# EAGLE design Lüftungssteuerung (EAGLE 7.2.0)
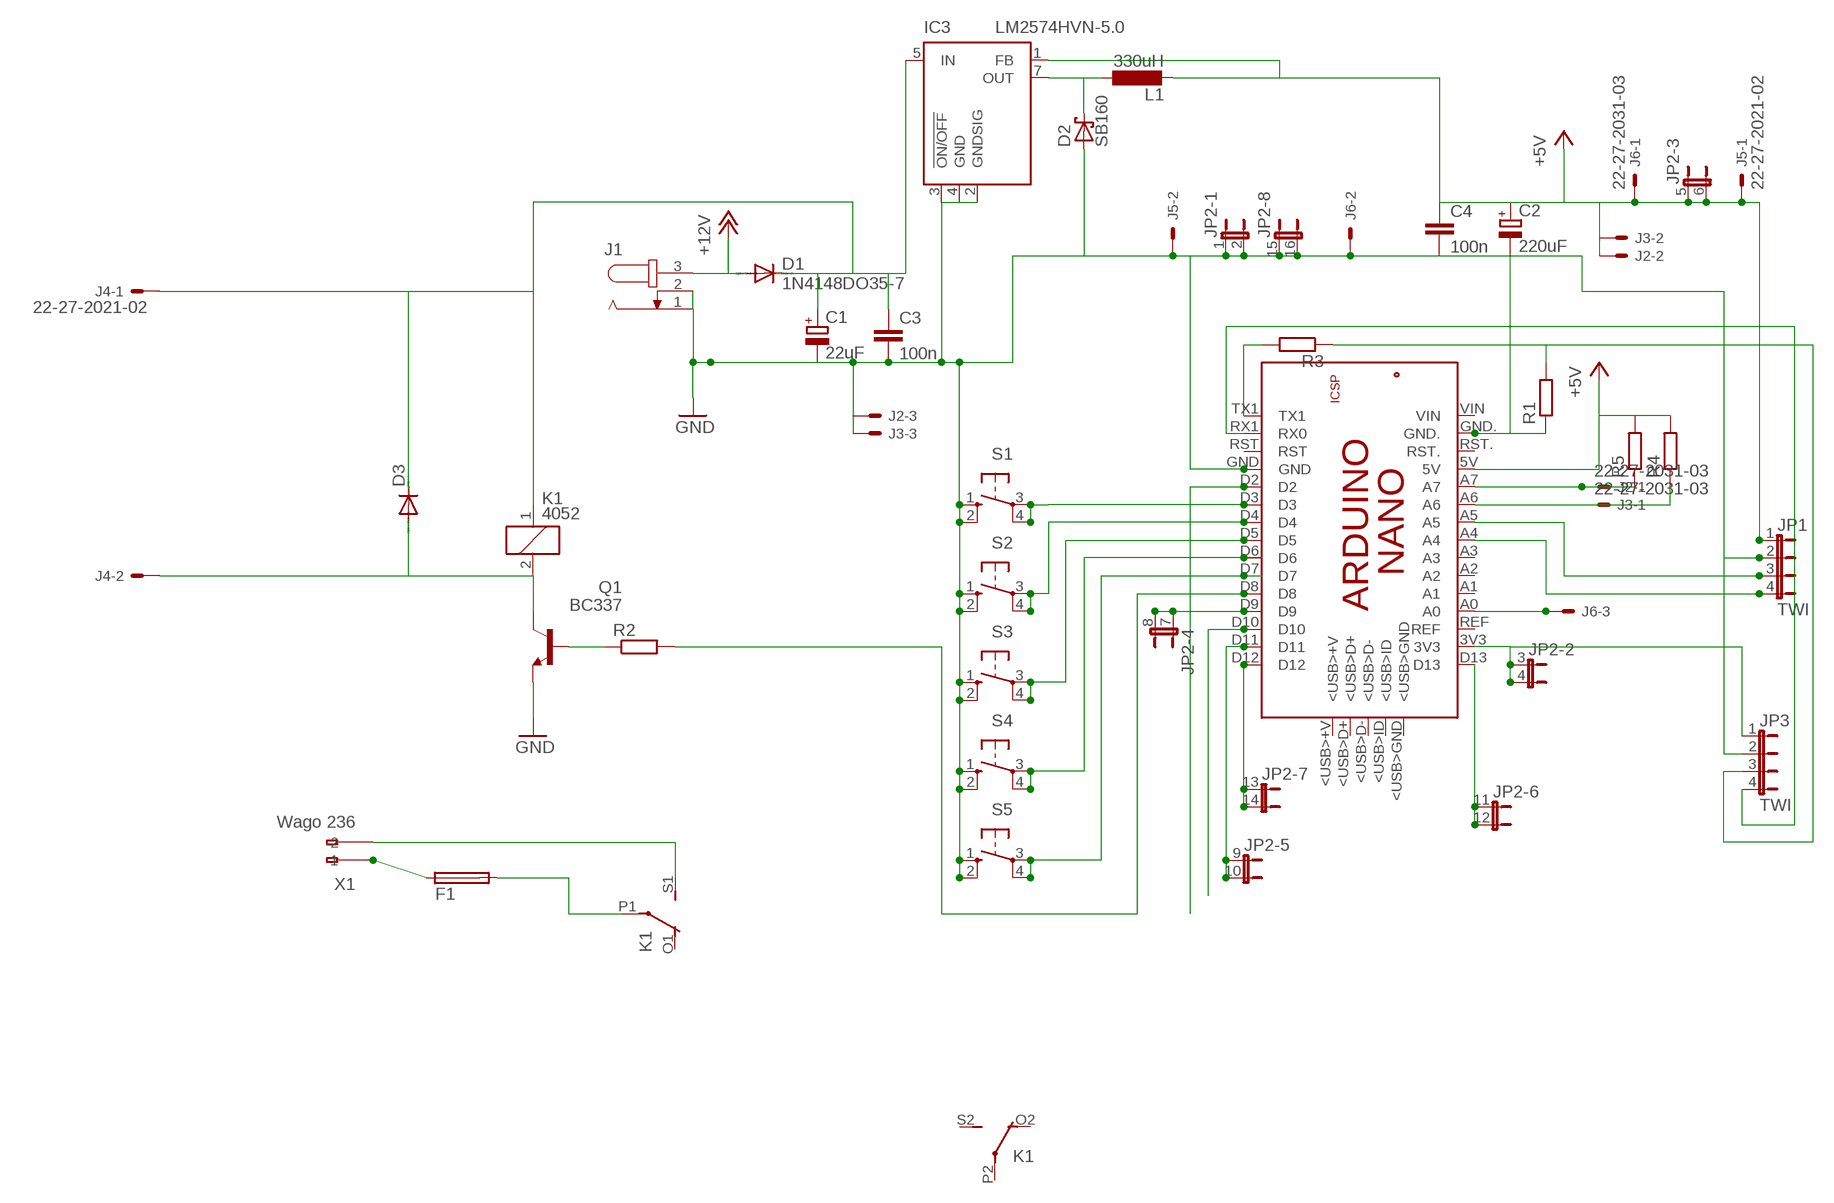
[diagram p0: schematic, sheet 1]

## Parts
C1  22uF  CPOL-EUE2-5  [E2-5]
C2  220uF  CPOL-EUE5-10.5  [E5-10,5]
C3  100n  C-EUC1206  [C1206]
C4  100n  C-EUC1206  [C1206]
D1  1N4148DO35-7  [DO35-7]
D2  SB160  1N5817-B  [DO41-7.6]
D3  DIODE-DO41-7.6  [DO41-7.6]
F1  SH22,5  [SH22,5]
IC3  LM2574HVN-5.0  [DIL08]
J1  JACK-PLUG0  [SPC4077]
J2  22-27-2031-03  [6410-03]
J3  22-27-2031-03  [6410-03]
J4  22-27-2021-02  [6410-02]
J5  22-27-2021-02  [6410-02]
J6  22-27-2031-03  [6410-03]
JP1  TWI  JP4E  [JP4]
JP2  JP8QE  [JP8Q]
JP3  TWI  JP4E  [JP4]
K1  4052  [F4052]
L1  330uH  L-EUPIS47XX  [PIS47XX]
PCB1  ARDUINO_NANO  [ARDUINO_NANO]
Q1  BC337  [TO92]
R1  R-EU_R1206  [R1206]
R2  R-EU_R1206  [R1206]
R3  R-EU_R1206  [R1206]
R4  R-EU_R1206  [R1206]
R5  R-EU_R1206  [R1206]
S1  10-XX  [B3F-10XX]
S2  10-XX  [B3F-10XX]
S3  10-XX  [B3F-10XX]
S4  10-XX  [B3F-10XX]
S5  10-XX  [B3F-10XX]
X1  Wago 236  255-402-508  [255-402-508]

## Nets
+5V: C2.+ C4.1 IC3.1(FB) J2.2 J3.2 J5.1 J6.1 JP1.1 JP2.5 JP2.6 L1.1 PCB1.5V R4.2 R5.2
+12V: D1.A J1.3
GND: C1.- C2.- C3.2 C4.2 D2.A IC3.2(GNDSIG) IC3.3(!ON/OFF) IC3.4(GND) J1.1 J1.2 J2.3 J3.3 J5.2 J6.2 JP1.2 JP2.1 JP2.2 JP2.15 JP2.16 JP3.2 PCB1.GND PCB1.GND. Q1.1(E) R1.1 S1.1(S) S1.2(S1) S2.1(S) S2.2(S1) S3.1(S) S3.2(S1) S4.1(S) S4.2(S1) S5.1(S) S5.2(S1)
N$1: C1.+ C3.1 D1.C D3.C IC3.5(IN) J4.1 K1.1
N$2: JP1.3 PCB1.A5
N$3: J2.1 PCB1.A7 R5.1
N$4: J3.1 PCB1.A6 R4.1
N$5: JP1.4 PCB1.A4
N$6: JP2.7 JP2.8 PCB1.D9
N$7: J6.3 PCB1.A0
N$9: JP3.4 PCB1.RX1(RX0)
N$10: PCB1.TX1 R3.2
N$11: JP3.3 R1.2 R3.1
N$12: JP2.11 JP2.12 PCB1.D13
N$13: PCB1.D3 S1.3(P) S1.4(P1)
N$14: PCB1.D4 S2.3(P) S2.4(P1)
N$15: D3.A J4.2 K1.2 Q1.3(C)
N$16: Q1.2(B) R2.1
N$17: PCB1.D7 S5.3(P) S5.4(P1)
N$18: JP2.3 JP2.4 JP3.1 PCB1.3V3
N$19: JP2.13 JP2.14 PCB1.D12
N$20: JP2.9 JP2.10 PCB1.D11
N$22: PCB1.D10
N$23: PCB1.D2
N$24: PCB1.D6 S4.3(P) S4.4(P1)
N$25: PCB1.D5 S3.3(P) S3.4(P1)
N$26: PCB1.D8 R2.2
N$27: K1.S1(2:S) X1.A2(-2)
N$28: F1.2 K1.P1(2:P)
N$29: F1.1 X1.A1(-1)
N$33: D2.C IC3.7(OUT) L1.2
Unconnected: K1.O1(2:O) K1.O2(3:O) K1.P2(3:P) K1.S2(3:S) PCB1.5V. PCB1.<USB>+V PCB1.<USB>D+ PCB1.<USB>D- PCB1.<USB>GND PCB1.<USB>ID PCB1.A1 PCB1.A2 PCB1.A3 PCB1.GND_ PCB1.MISO PCB1.MOSI PCB1.REF PCB1.RESET.. PCB1.RST PCB1.RST. PCB1.SCK PCB1.VIN X1.B1(B-1) X1.B2(B-2)

## Library data of the parts
C1 C2 = rcl:CPOL-EU: POLARIZED CAPACITOR, European symbol
C3 C4 = rcl:C-EU: CAPACITOR, European symbol
D1 = diode:1N4148: DIODE high speed (Philips)
D2 = diode:1N581*: 1.0A SCHOTTKY BARRIER RECTIFIER Source: http://www.diodes.com/datasheets/ds23001.pdf
D3 = diode:DIODE-: DIODE
F1 = fuse:SH22,5: FUSE HOLDER grid 22,5 mm, OGN0031 8201, Schurter (Buerklin); MF: SCHURTER; MPN: 0031.8201; OC_FARNELL: 1162740; OC_NEWARK: 96F8317
IC3 = linear:LM2574?-*: SIMPLE SWITCHER 0.5A Step-Down Voltage Regulator Source: http://cache.national.com/ds/LM/LM2574.pdf
J1 = con-jack:JACK-PLUG: DC POWER JACK Power Jack, DC, Right Angle, Through Hole, Rated 5A at 16VDC, PC Terminals Distributor: Farnell (www.Farnell.de) Drawing: 84N1161.pdf / 84N1162.pdf Manufacturer: SPC Technology (www.spctechnology.com) Type: SPC4077 / SPC 4078; OC_FARNELL: unknown; OC_NEWARK: unknown
J2 J3 J6 = con-molex:22-?-03: CONNECTOR wire to board 2.54 mm (.1 inch) pitch header; OC_FARNELL: unknown; OC_NEWARK: unknown
J4 J5 = con-molex:22-?-02: CONNECTOR wire to board 2.54 mm (.1 inch) pitch header; OC_FARNELL: unknown; OC_NEWARK: unknown
JP1 JP3 = jumper:JP4E: JUMPER
JP2 = jumper:JP8QE: JUMPER
K1 = relay:4052: RELAY 2 x switch, Finder; OC_FARNELL: unknown; OC_NEWARK: unknown
L1 = Inductor-Fastron:L-EU
PCB1 = E14_Arduino_revB:ARDUINO_NANO: Device for representing an Arduino Nano board with a footprint in an EAGLE design. Created by Dave Young for Element14. More EAGLE documentation at: http://www.element14.com/community/community/knode/cadsoft_eagle
Q1 = transistor-npn:BC337*: NPN Transistor
R1-R5 = rcl:R-EU_: RESISTOR, European symbol
S1-S5 = switch-omron:10-XX: OMRON SWITCH; MPN: B3F-1000; OC_FARNELL: 176432; OC_NEWARK: 36M3542
X1 = con-wago255:255-402-5: WAGO; OC_FARNELL: unknown; OC_NEWARK: unknown

## Board
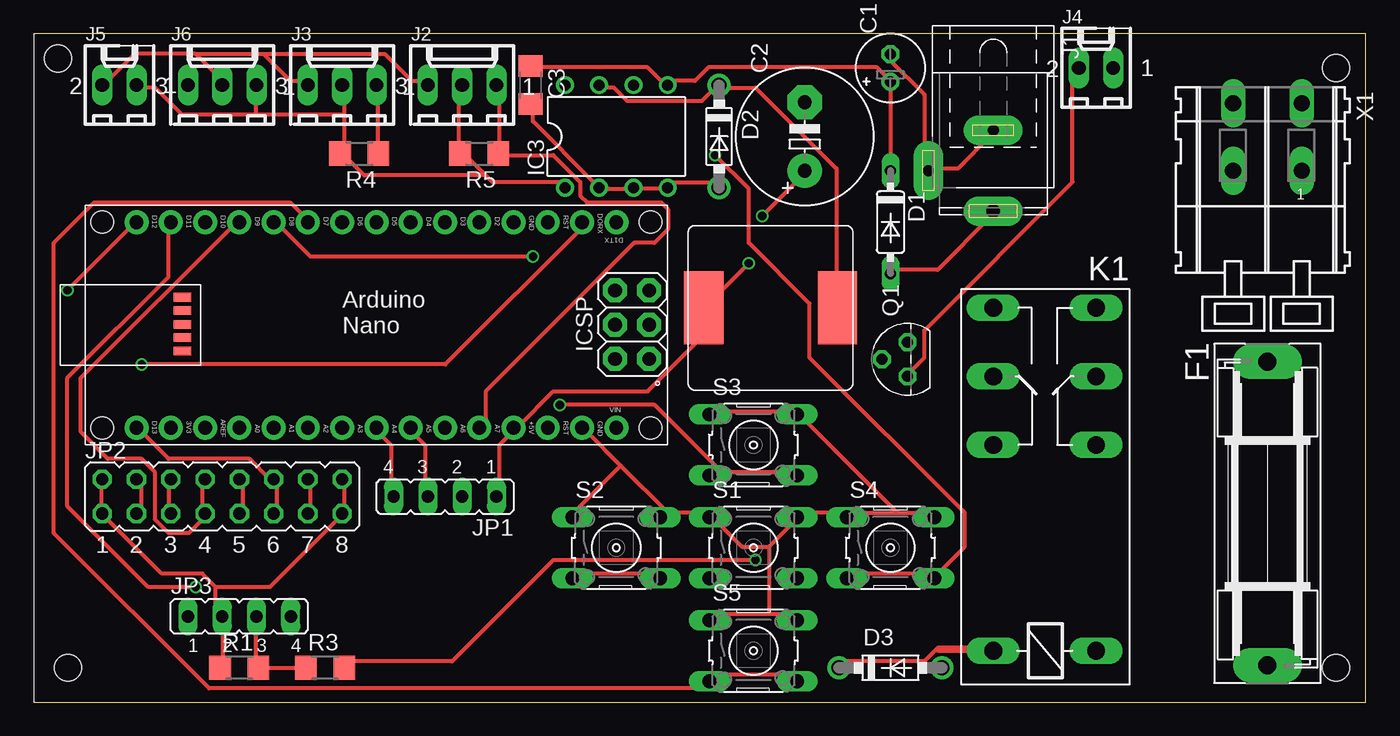
[diagram p1: board, top side]
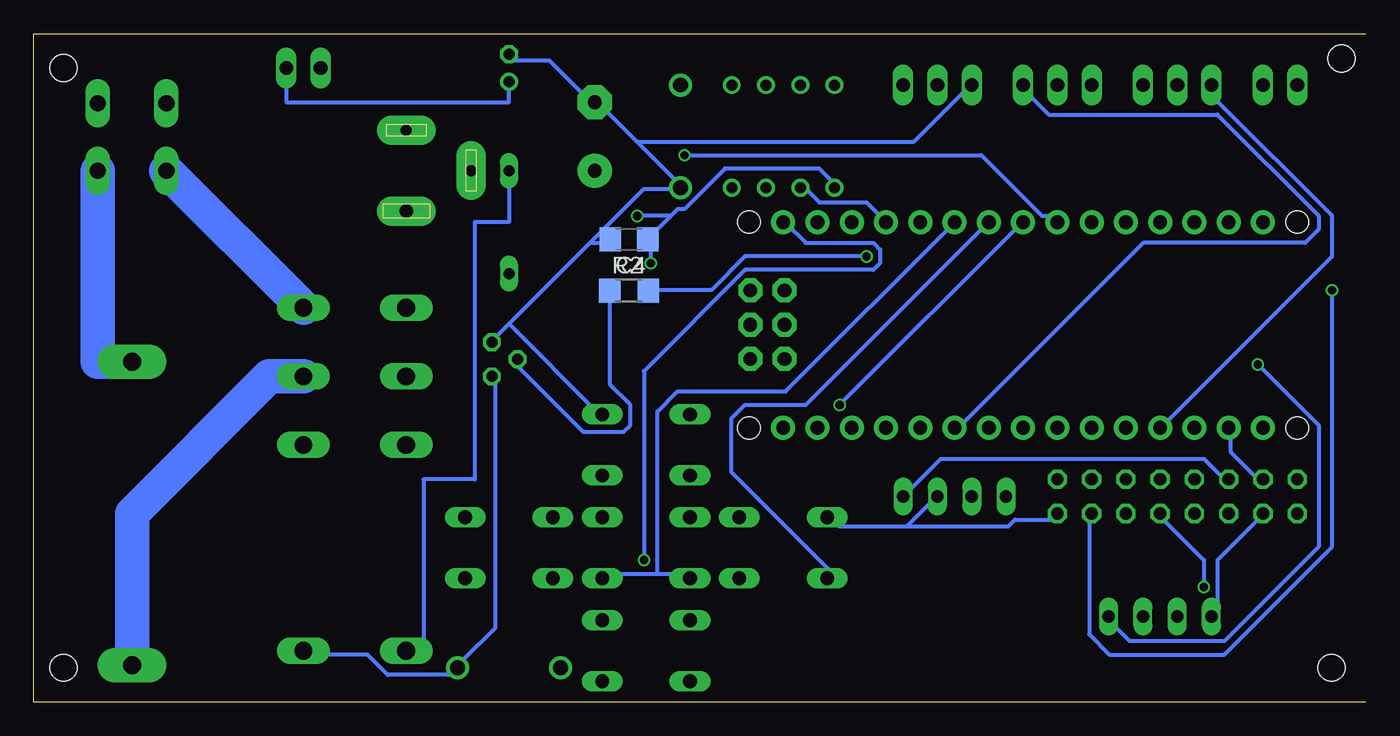
[diagram p2: board, bottom side, seen from below]

Size 98.73 x 49.52 mm. Coordinates in mm from the lower left corner, seen from the top.
Outline: 0,0 98.73,0 98.73,49.52 0,49.52
Copper layers (1*16): Top 0.035mm / dielectric 1.5mm / Bottom 0.035mm
Design rules "SeeedStudio_2layer_DRU_no_angle_20140221 *": minimum track width 12mil, minimum drill 24mil, track to track 10mil, track to pad 10mil, pad to pad 10mil, via to via 10mil, smd to smd 0mil, copper to edge 10mil, drill to drill 10mil, minimum pad ring 10mil, minimum via ring 6mil, stop-mask expansion 2mil, vias tented up to drill 100mil, thermal gap 10mil
Holes 2 mm at 1.8,47.69 2.54,2.54 96.52,2.54 96.52,46.99
tRestrict: area 74.9,0.6 to 98.4,48.3
bRestrict: area 74.9,0.6 to 98.4,48.3

### Footprints (pad centres in the part's own frame; a part is rotated, then mirrored left to right if it is on the bottom)
E2-5 = drill 0.813 pad 1.27: + -1.016,0 | drill 0.813 pad 1.27 octagon: - 1.016,0
E5-10,5 = drill 1.016 pad 2.54: + -2.54,0 | drill 1.016 pad 2.54 octagon: - 2.54,0
C1206 = smd 1.6 x 1.8: 1 -1.4,0; 2 1.4,0
DO35-7 = drill 0.813 long: A 3.81,0; C -3.81,0
DO41-7.6 = drill 1.1 pad 1.7: A 3.81,0; C -3.81,0
SH22,5 = drill 1.321 pad 2.54 long: 1 -11.252,0; 2 11.252,0
DIL08 = drill 0.813 pad 1.27: 1 -3.81,-3.81; 2 -1.27,-3.81; 3 1.27,-3.81; 4 3.81,-3.81; 5 3.81,3.81; 6 1.27,3.81; 7 -1.27,3.81; 8 -3.81,3.81
SPC4077 = drill 0.8 pad 2.184 long: 1 -3,0; 2 0,-4.8 | drill 1 pad 2.184 long: 3 3,0
6410-03 = drill 1.016 long: 1 2.54,0; 2 0,0; 3 -2.54,0
6410-02 = drill 1.016 long: 1 1.27,0; 2 -1.27,0
JP4 = drill 0.914 long: 1 -3.81,0; 2 -1.27,0; 3 1.27,0; 4 3.81,0
JP8Q = drill 0.914 octagon: 1 -8.89,-1.27; 2 -8.89,1.27; 3 -6.35,-1.27; 4 -6.35,1.27; 5 -3.81,-1.27; 6 -3.81,1.27; 7 -1.27,-1.27; 8 -1.27,1.27; 9 1.27,-1.27; 10 1.27,1.27; 11 3.81,-1.27; 12 3.81,1.27; 13 6.35,-1.27; 14 6.35,1.27; 15 8.89,-1.27; 16 8.89,1.27
F4052 = drill 1.321 long: 1 -3.81,3.81; 2 -3.81,-3.81; O1 11.43,-3.81; O2 11.43,3.81; P1 16.51,-3.81; P2 16.51,3.81; S1 21.59,-3.81; S2 21.59,3.81
PIS47XX = smd 2.9 x 5.4: 1 -4.95,0; 2 4.95,0
ARDUINO_NANO = drill 1.016 pad 1.778: 3V3 6.35,1.27; 5V 31.75,1.27; A0 11.43,1.27; A1 13.97,1.27; A2 16.51,1.27; A3 19.05,1.27; A4 21.59,1.27; A5 24.13,1.27; A6 26.67,1.27; A7 29.21,1.27; D2 29.21,16.51; D3 26.67,16.51; D4 24.13,16.51; D5 21.59,16.51; D6 19.05,16.51; D7 16.51,16.51; D8 13.97,16.51; D9 11.43,16.51; D10 8.89,16.51; D11 6.35,16.51; D12 3.81,16.51; D13 3.81,1.27; GND 31.75,16.51; GND. 36.83,1.27; REF 8.89,1.27; RST 34.29,16.51; RST. 34.29,1.27; RX1 36.83,16.51; TX1 39.37,16.51; VIN 39.37,1.27 | drill 1.016 pad 1.778 octagon: 5V. 39.268,6.375; GND_ 39.268,11.455; MISO 41.808,6.375; MOSI 39.268,8.915; RESET.. 41.808,11.455; SCK 41.808,8.915 | smd 1.27 x 0.635: <USB>+V 7.214,10.947; <USB>D+ 7.214,9.957; <USB>D- 7.214,8.941; <USB>GND 7.214,6.96; <USB>ID 7.214,7.976 | hole 1.651: 1.27,1.27; 1.27,16.51; 41.91,16.51; 41.91,1.27
TO92 = drill 0.813 octagon: 1 1.27,0; 2 0,1.905; 3 -1.27,0
R1206 = smd 1.6 x 1.803: 1 -1.422,0; 2 1.422,0
B3F-10XX = drill 1.016 long: 1 -3.251,2.261; 2 3.251,2.261; 3 -3.251,-2.261; 4 3.251,-2.261
255-402-508 = drill 1.2 long: A1 -2.54,0; A2 2.54,0; B1 -2.54,-5; B2 2.54,-5

### Placement (x,y rotation side)
C1  63.5,46.99 90 top
C2  57.15,41.91 90 top
C3  36.83,45.72 270 top
C4  54.61,34.29 180 bottom
D1  63.5,35.56 270 top
D2  50.8,41.91 270 top
D3  63.5,2.54 0 top
F1  91.44,13.97 270 top
IC3  43.18,41.91 0 top
J1  71.12,39.37 270 top
J2  31.75,45.72 0 top
J3  22.86,45.72 0 top
J4  78.74,46.99 0 top
J5  6.35,45.72 0 top
J6  13.97,45.72 0 top
JP1  30.48,15.24 180 top
JP2  13.97,15.24 0 top
JP3  15.24,6.35 0 top
K1  74.93,7.62 90 top
L1  54.61,29.21 0 top
PCB1  3.81,19.05 0 top
Q1  64.77,25.4 90 top
R1  15.24,2.54 0 top
R2  54.61,30.48 0 bottom
R3  21.59,2.54 0 top
R4  24.13,40.64 180 top
R5  33.02,40.64 180 top
S1  53.34,11.43 0 top
S2  43.18,11.43 0 top
S3  53.34,19.05 0 top
S4  63.5,11.43 0 top
S5  53.34,3.81 0 top
X1  91.44,39.37 180 top

### Tracks (layer width: path | path; a pad name or v marks a point on that pad's centre or on a via)
+5V  (via drill 0.61)
  Top 0.305: JP2.5 10,14.02 10,16.02 JP2.6 | JP1.1 34.5,15.52 34.5,19.02 35.5,20.02 PCB1.5V 36,20.52 38.5,23.02 45.5,23.02 49.5,27.02 49.5,29.02 L1.1 50,29.52 v53,32.52 | 23,43.52 23,45.52 J3.2 | 23,43.52 23,41.02 R4.2 23,40.52 24.5,39.02 33.5,39.02 | 23,43.52 16.5,43.52 | 16.5,43.52 11,43.52 9,45.52 8,45.52 J5.1 | 16.5,43.52 16.5,45.52 J6.1 | J2.2 31.5,45.52 31.5,41.02 R5.2 32,40.52 33.5,39.02 | 33.5,39.02 34,38.52 39,38.52 IC3.1 | v54,36.02 57,39.02 C2.+
  Bottom 0.305: JP2.6 10.5,16.52 12,18.02 31.5,18.02 34,15.52 JP1.1 | 51.5,36.02 51,36.52 50.5,36.52 47.5,39.52 40.5,39.52 39.5,38.52 IC3.1 | 51.5,36.02 53,34.52 C4.1 53,34.02 v53,32.52 | 51.5,36.02 v54,36.02
+12V
  Top 0.305: D1.A 63.5,32.02 67,32.02 71,36.02 J1.3
GND
  Top 0.305: 12,48.02 7.5,48.02 5.5,46.02 J5.2 | 12,48.02 14,46.02 J6.2 | 17,48.02 19,46.02 20,46.02 J3.3 | 12,48.02 17,48.02 | 17,48.02 26,48.02 28,46.02 29,46.02 J2.3 | D2.A 50.5,38.52 47,38.52 IC3.4 46.5,38.02 44.5,38.02 IC3.3 44,38.02 42,38.02 IC3.2 41.5,38.52 37,43.02 37,44.02 C3.2 | J1.1 71,42.02 68.5,39.52 66.5,39.52 J1.2 66,39.52 66,45.02 63.5,47.52 C1.- | S3.1 50.5,21.52 56.5,21.52 S3.2 57,21.02 64,14.02 | 54.5,6.52 56.5,6.52 S5.2 | 54.5,6.52 50.5,6.52 S5.1 | 64,14.02 60.5,14.02 S4.1 60,14.02 57,14.02 S1.2 56.5,13.52 54.5,11.52 | 64,14.02 66.5,14.02 S4.2 | 54.5,11.52 54.5,6.52 | JP2.2 5,16.02 5,14.02 JP2.1 5.5,13.52 9.5,9.52 12.5,9.52 13.5,8.52 | R1.1 14,3.02 14,6.02 JP3.2 13.5,6.52 13.5,8.52 | 47,14.02 50,14.02 S1.1 50.5,13.52 52.5,11.52 54.5,11.52 | 47,14.02 46.5,14.02 S2.2 47,14.02 | 47,14.02 43.5,17.52 | 43.5,17.52 41,20.02 PCB1.GND. | JP2.16 23,16.02 23,14.02 JP2.15 22.5,13.52 17.5,8.52 13.5,8.52 | 43.5,17.52 40,14.02 S2.1
  Bottom 0.305: PCB1.GND 36,36.02 37,37.02 40.5,37.02 41.5,38.02 IC3.2 | C1.- 63.5,47.52 60.5,47.52 57.5,44.52 C2.- 57,44.52 54,41.52 | 54,41.52 51,38.52 D2.A 51,38.02 53.5,38.02 57.5,34.02 | 54,41.52 33.5,41.52 29.5,45.52 J2.3 | 57.5,34.02 56.5,34.02 C4.2 | 63.5,28.02 64.5,27.02 Q1.1 | 63.5,28.02 57.5,34.02 | 63.5,28.02 57,21.52 S3.2 | 34,13.02 32,15.02 JP1.2 | 34,13.02 39,13.02 39.5,13.52 S2.1 | 34,13.02 26.5,13.02 26,13.52 23,13.52 JP2.15
N$1
  Top 0.305: 67,4.02 66,3.02 60,3.02 D3.C | 67,4.02 71,4.02 K1.1 67,3.81 67,4.02 | C3.1 37,47.02 45.5,47.02 46.5,46.02 IC3.5 47,46.02 49,46.02 50,47.02 62.5,47.02 63.5,46.02 C1.+ D1.C
  Bottom 0.305: J4.1 80.01,44.45 63.5,44.45 C1.+ | D1.C 63.5,35.56 66.04,35.56 66.04,16.51 69.85,16.51 69.85,3.81 K1.1
N$2
  Top 0.305: JP1.3 29,15.52 29,19.02 28,20.02 PCB1.A5
N$3
  Top 0.305: J2.1 34.5,45.52 34.5,41.02 R5.1 34.5,40.52 38.5,40.52 40.5,38.52 40.5,37.52 41,37.02 46.5,37.02 47,36.52 47,35.02 46,34.02 44.5,34.02 33.5,23.02 33.5,20.52 PCB1.A7
N$4
  Top 0.305: R4.1 25.5,41.02 25.5,45.52 J3.1
  Bottom 0.305: PCB1.A6 30,20.52 16.5,34.02 4.5,34.02 3.5,35.02 3.5,36.02 11,43.52 23.5,43.52 25.5,45.52 J3.1
N$5
  Top 0.305: JP1.4 26.5,15.52 26.5,19.02 25.5,20.02 PCB1.A4
N$6
  Top 0.305: JP2.8 12.5,16.02 12.5,14.02 JP2.7 12.5,13.52 11.5,12.52 10,12.52 9,13.52 9,17.02 8,18.02 5.5,18.02 3.5,20.02 3.5,24.02 15,35.52 PCB1.D9
N$7
  Bottom 0.305: J6.3 11,45.52 11,44.52 2.5,36.02 2.5,33.02 15,20.52 PCB1.A0
N$9  (via drill 0.61)
  Top 0.305: v8,25.02 30.5,25.02 41,35.52 PCB1.RX1
  Bottom 0.305: v8,25.02 3.5,20.52 3.5,11.52 10.5,4.52 17.5,4.52 19,6.02 JP3.4
N$10  (via drill 0.61)
  Top 0.305: v53.5,10.52 38.5,10.52 31,3.02 23.5,3.02 R3.2
  Bottom 0.305: v53.5,10.52 53.5,24.52 46,32.02 36.5,32.02 36,32.52 36,33.52 36.5,34.02 41.5,34.02 43,35.52 PCB1.TX1
N$11
  Top 0.305: R3.1 20,2.52 17,2.52 R1.2 16.5,3.02 16.5,6.02 JP3.3
N$12
  Top 0.305: JP2.11 18,14.02 18,16.02 JP2.12 17.5,16.52 16,18.02 10,18.02 8,20.02 PCB1.D13
N$13
  Bottom 0.305: 52.5,9.52 56.5,9.52 S1.4 | 52.5,9.52 50.5,9.52 S1.3 | 52.5,9.52 52.5,21.52 51,23.02 43,23.02 30.5,35.52 PCB1.D3
N$14
  Top 0.305: S2.3 40,9.52 46,9.52 S2.4
  Bottom 0.305: PCB1.D4 28,35.52 41.5,22.02 46,22.02 47,21.02 47,17.02 39.5,9.52 S2.3
N$15
  Top 0.305: J4.2 77,46.52 77,38.52 66,27.52 66,25.52 65,24.52 Q1.3
  Bottom 0.305: Q1.3 64.5,24.02 64.5,5.52 67,3.02 D3.A 67.5,2.52 68,2.02 72.5,2.02 74,3.52 78.5,3.52 K1.2
N$16
  Bottom 0.305: R2.1 56,30.02 56,23.52 54.5,22.02 54.5,20.52 55,20.02 58,20.02 63,25.02 Q1.2
N$17
  Top 0.305: S5.4 56.5,2.02 50.5,2.02 S5.3 50,1.52 49.5,1.02 13,1.02 1.5,12.52 1.5,34.02 4.5,37.02 19,37.02 20,36.02 PCB1.D7
N$18
  Top 0.305: JP2.4 8,16.02 8,14.02 JP2.3
  Bottom 0.305: JP3.1 11,6.52 11,10.52 8,13.52 JP2.3 | PCB1.3V3 10,20.02 10,18.52 8,16.52 JP2.4
N$19  (via drill 0.61)
  Top 0.305: JP2.13 20.5,14.02 20.5,16.02 JP2.14 | v2.5,30.52 7.5,35.52 PCB1.D12
  Bottom 0.305: v2.5,30.52 2.5,11.52 10.5,3.52 19,3.52 20.5,5.02 20.5,13.52 JP2.13
N$20  (via drill 0.61)
  Top 0.305: JP2.9 15.5,14.02 15.5,16.02 JP2.10 | v12,8.52 8.5,8.52 2.5,14.52 2.5,24.02 10,31.52 10,35.52 PCB1.D11
  Bottom 0.305: v12,8.52 12,10.52 15,13.52 JP2.9
N$24  (via drill 0.61)
  Top 0.305: S4.3 60.5,9.52 66.5,9.52 S4.4 67,9.52 69,11.52 69,14.02 57.5,25.52 57.5,29.52 53,34.02 53,38.02 v50.5,40.52
  Bottom 0.305: v50.5,40.52 28.5,40.52 24,36.02 23,36.02 PCB1.D6
N$25  (via drill 0.61)
  Top 0.305: 51,17.02 56.5,17.02 S3.4 | 51,17.02 50.5,17.02 S3.3 51,17.02 | v39,22.02 46,22.02 51,17.02
  Bottom 0.305: v39,22.02 25.5,35.52 PCB1.D5
N$26  (via drill 0.61)
  Top 0.305: v37,33.02 20.5,33.02 18,35.52 PCB1.D8
  Bottom 0.305: v37,33.02 46,33.02 48.5,30.52 53,30.52 R2.2
N$27
  Bottom 2.54: X1.A2 K1.S1
N$28
  Bottom 2.54: K1.P1 81.28,24.13 91.44,13.97 F1.2
N$29
  Bottom 2.54: F1.1 93.98,25.22 X1.A1
N$33
  Top 0.305: IC3.7 42,45.52 43,45.52 44,44.52 49.5,44.52 50.5,45.52 D2.C 51,45.52 53.5,45.52 59.5,39.52 59.5,29.52 L1.2